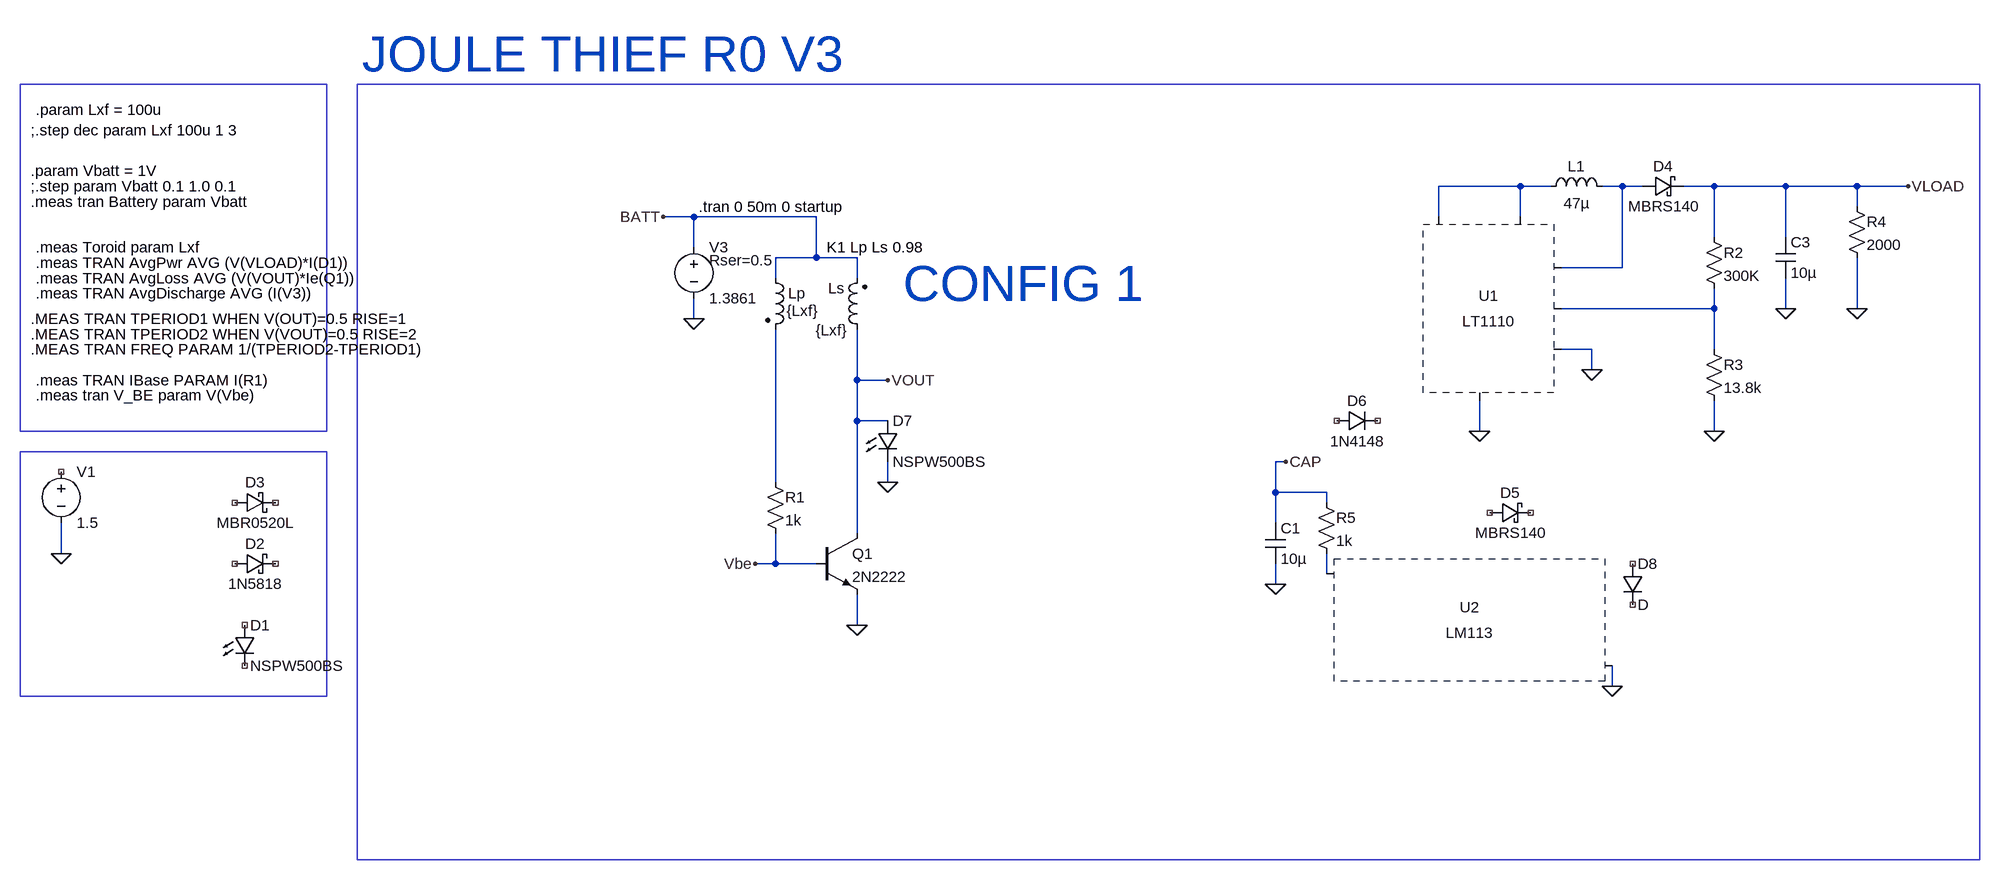
[diagram p0: schematic Joule Thief R0 V3.asc]
Joule Thief R0 V3.asc, the LTspice schematic file:
Version 4
SHEET 1 4580 788
WIRE 1584 -432 1456 -432
WIRE 1632 -432 1584 -432
WIRE 1744 -432 1712 -432
WIRE 1776 -432 1744 -432
WIRE 1888 -432 1840 -432
WIRE 2000 -432 1888 -432
WIRE 2112 -432 2000 -432
WIRE 2192 -432 2112 -432
WIRE 2112 -400 2112 -432
WIRE 288 -384 240 -384
WIRE 480 -384 288 -384
WIRE 1456 -384 1456 -432
WIRE 1584 -384 1584 -432
WIRE 1888 -352 1888 -432
WIRE 2000 -352 2000 -432
WIRE 288 -336 288 -384
WIRE 480 -320 480 -384
WIRE 480 -320 416 -320
WIRE 544 -320 480 -320
WIRE 1744 -304 1744 -432
WIRE 1744 -304 1648 -304
WIRE 416 -288 416 -320
WIRE 544 -288 544 -320
WIRE 1888 -240 1888 -272
WIRE 1888 -240 1648 -240
WIRE 2000 -240 2000 -288
WIRE 2112 -240 2112 -320
WIRE 288 -224 288 -256
WIRE 1696 -176 1648 -176
WIRE 1888 -176 1888 -240
WIRE 1696 -144 1696 -176
WIRE 544 -128 544 -208
WIRE 592 -128 544 -128
WIRE 544 -64 544 -128
WIRE 592 -64 544 -64
WIRE 1520 -48 1520 -96
WIRE 1888 -48 1888 -96
WIRE 1216 0 1200 0
WIRE 416 32 416 -208
WIRE 592 32 592 0
WIRE 1200 48 1200 0
WIRE 1280 48 1200 48
WIRE 1280 64 1280 48
WIRE 1200 96 1200 48
WIRE 544 112 544 -64
WIRE -704 144 -704 96
WIRE 416 160 416 112
WIRE 416 160 384 160
WIRE 480 160 416 160
WIRE 1280 176 1280 144
WIRE 1200 192 1200 160
WIRE 544 256 544 208
WIRE 1728 336 1728 320
WIRE 1728 352 1728 336
FLAG 288 -224 0
FLAG 384 160 Vbe
FLAG 592 -128 VOUT
FLAG 2192 -432 VLOAD
FLAG -704 144 0
FLAG 2000 -240 0
FLAG 544 256 0
FLAG 1520 -48 0
FLAG 1888 -48 0
FLAG 1696 -144 0
FLAG 2112 -240 0
FLAG 1200 192 0
FLAG 1216 0 CAP
FLAG 240 -384 BATT
FLAG 1728 352 0
FLAG 592 32 0
SYMBOL res 400 16 R0
WINDOW 0 31 40 Left 2
WINDOW 3 31 76 Left 2
SYMATTR InstName R1
SYMATTR Value 1k
SYMBOL npn 480 112 R0
SYMATTR InstName Q1
SYMATTR Value 2N2222
SYMBOL LED -432 256 R0
SYMATTR InstName D1
SYMATTR Value NSPW500BS
SYMBOL voltage 288 -352 R0
WINDOW 123 0 0 Left 0
WINDOW 39 24 36 Left 2
SYMATTR SpiceLine Rser=0.5
SYMATTR InstName V3
SYMATTR Value 1.3861
SYMBOL ind2 400 -304 R0
WINDOW 3 34 67 Left 2
SYMATTR Value {Lxf}
SYMATTR InstName Lp
SYMATTR SpiceLine Rser=0.176
SYMBOL ind2 560 -192 R180
WINDOW 0 36 80 Left 2
WINDOW 3 32 14 Left 2
SYMATTR InstName Ls
SYMATTR Value {Lxf}
SYMATTR SpiceLine Rser=0.176
SYMBOL schottky -432 176 R270
WINDOW 0 32 32 VTop 2
WINDOW 3 0 32 VBottom 2
SYMATTR InstName D2
SYMATTR Value 1N5818
SYMBOL PowerProducts\\LT1110 1520 -240 R0
SYMATTR InstName U1
SYMBOL ind 1616 -416 R270
WINDOW 0 32 56 VTop 2
WINDOW 3 5 56 VBottom 2
SYMATTR InstName L1
SYMATTR Value 47µ
SYMBOL schottky -432 48 M90
WINDOW 0 0 32 VBottom 2
WINDOW 3 32 32 VTop 2
SYMATTR InstName D3
SYMATTR Value MBR0520L
SYMBOL cap 1984 -352 R0
SYMATTR InstName C3
SYMATTR Value 10µ
SYMBOL voltage -704 0 R0
WINDOW 123 0 0 Left 0
WINDOW 39 0 0 Left 0
SYMATTR InstName V1
SYMATTR Value 1.5
SYMBOL RES 1872 -368 R0
WINDOW 0 31 40 Left 2
WINDOW 3 31 76 Left 2
SYMATTR InstName R2
SYMATTR Value 300K
SYMBOL RES 1872 -192 R0
WINDOW 0 31 40 Left 2
WINDOW 3 31 76 Left 2
SYMATTR InstName R3
SYMATTR Value 13.8k
SYMBOL schottky 1776 -416 R270
WINDOW 0 32 32 VTop 2
WINDOW 3 0 32 VBottom 2
SYMATTR InstName D4
SYMATTR Value MBRS140
SYMBOL res 2096 -416 R0
WINDOW 0 31 40 Left 2
WINDOW 3 31 76 Left 2
SYMATTR InstName R4
SYMATTR Value 2000
SYMBOL schottky 1536 96 R270
WINDOW 0 32 32 VTop 2
WINDOW 3 0 32 VBottom 2
SYMATTR InstName D5
SYMATTR Value MBRS140
SYMBOL cap 1184 96 R0
SYMATTR InstName C1
SYMATTR Value 10µ
SYMBOL REF\\LM113 1712 272 R0
SYMATTR InstName U2
SYMBOL diode 1296 -48 R270
WINDOW 0 32 32 VTop 2
WINDOW 3 0 32 VBottom 2
SYMATTR InstName D6
SYMATTR Value 1N4148
SYMBOL LED 576 -64 R0
SYMATTR InstName D7
SYMATTR Value NSPW500BS
SYMBOL res 1264 48 R0
WINDOW 0 31 40 Left 2
WINDOW 3 31 76 Left 2
SYMATTR InstName R5
SYMATTR Value 1k
SYMBOL diode 1744 160 R0
SYMATTR InstName D8
TEXT 496 -336 Left 2 !K1 Lp Ls 0.98
TEXT -744 -552 Left 2 !.param Lxf = 100u
TEXT -752 -520 Left 2 !;.step dec param Lxf 100u 1 3
TEXT -744 -312 Left 2 !.meas TRAN AvgPwr AVG (V(VLOAD)*I(D1))
TEXT -744 -336 Left 2 !.meas Toroid param Lxf
TEXT -752 -224 Left 2 !.MEAS TRAN TPERIOD1 WHEN V(OUT)=0.5 RISE=1
TEXT -752 -200 Left 2 !.MEAS TRAN TPERIOD2 WHEN V(VOUT)=0.5 RISE=2
TEXT -752 -176 Left 2 !.MEAS TRAN FREQ PARAM 1/(TPERIOD2-TPERIOD1)
TEXT -744 -288 Left 2 !.meas TRAN AvgLoss AVG (V(VOUT)*Ie(Q1))
TEXT -752 -456 Left 2 !.param Vbatt = 1V
TEXT -752 -432 Left 2 !;.step param Vbatt 0.1 1.0 0.1
TEXT -752 -408 Left 2 !.meas tran Battery param Vbatt
TEXT 296 -400 Left 2 !.tran 0 50m 0 startup
TEXT -744 -128 Left 2 !.meas TRAN IBase PARAM I(R1)
TEXT -744 -104 Left 2 !.meas tran V_BE param V(Vbe)
TEXT -232 -640 Left 6 ;JOULE THIEF R0 V3
TEXT -744 -264 Left 2 !.meas TRAN AvgDischarge AVG (I(V3))
TEXT 616 -280 Left 6 ;CONFIG 1
RECTANGLE Normal -288 -48 -768 -592
RECTANGLE Normal -288 368 -768 -16
RECTANGLE Normal 2304 624 -240 -592

The netlist it stands for:
* Joule Thief R0 V3.asc
R1 N004 Vbe 1k
Q1 VOUT Vbe 0 0 2N2222
D1 NC_01 NC_02 NSPW500BS
V3 BATT 0 1.3861 Rser=0.5
Lp BATT N004 {Lxf} Rser=0.176
Ls VOUT BATT {Lxf} Rser=0.176
D2 NC_03 NC_04 1N5818
* U1: LT1110 (symbol PowerProducts\LT1110 not available, pin order unknown); nets seen at it: 0, N001, N002, N003
L1 N001 N002 47µ
D3 NC_05 NC_06 MBR0520L
C3 VLOAD 0 10µ
V1 NC_07 0 1.5
R2 VLOAD N003 300K
R3 N003 0 13.8k
D4 N002 VLOAD MBRS140
R4 VLOAD 0 2000
D5 NC_08 NC_09 MBRS140
C1 CAP 0 10µ
* U2: LM113 (symbol REF\LM113 not available, pin order unknown); nets seen at it: 0, N005
D6 NC_10 NC_11 1N4148
D7 VOUT 0 NSPW500BS
R5 CAP N005 1k
D8 NC_12 NC_13 D
.model D D
.lib standard.dio
.model NPN NPN
.model PNP PNP
.lib standard.bjt
K1 Lp Ls 0.98
.param Lxf = 100u
;.step dec param Lxf 100u 1 3
.meas TRAN AvgPwr AVG (V(VLOAD)*I(D1))
.meas Toroid param Lxf
.MEAS TRAN TPERIOD1 WHEN V(OUT)=0.5 RISE=1
.MEAS TRAN TPERIOD2 WHEN V(VOUT)=0.5 RISE=2
.MEAS TRAN FREQ PARAM 1/(TPERIOD2-TPERIOD1)
.meas TRAN AvgLoss AVG (V(VOUT)*Ie(Q1))
.param Vbatt = 1V
;.step param Vbatt 0.1 1.0 0.1
.meas tran Battery param Vbatt
.tran 0 50m 0 startup
.meas TRAN IBase PARAM I(R1)
.meas tran V_BE param V(Vbe)
* JOULE THIEF R0 V3
.meas TRAN AvgDischarge AVG (I(V3))
* CONFIG 1
.backanno
.end